# EAGLE design Shield1 (EAGLE 7.2.0)

## Sheet 1 of 2
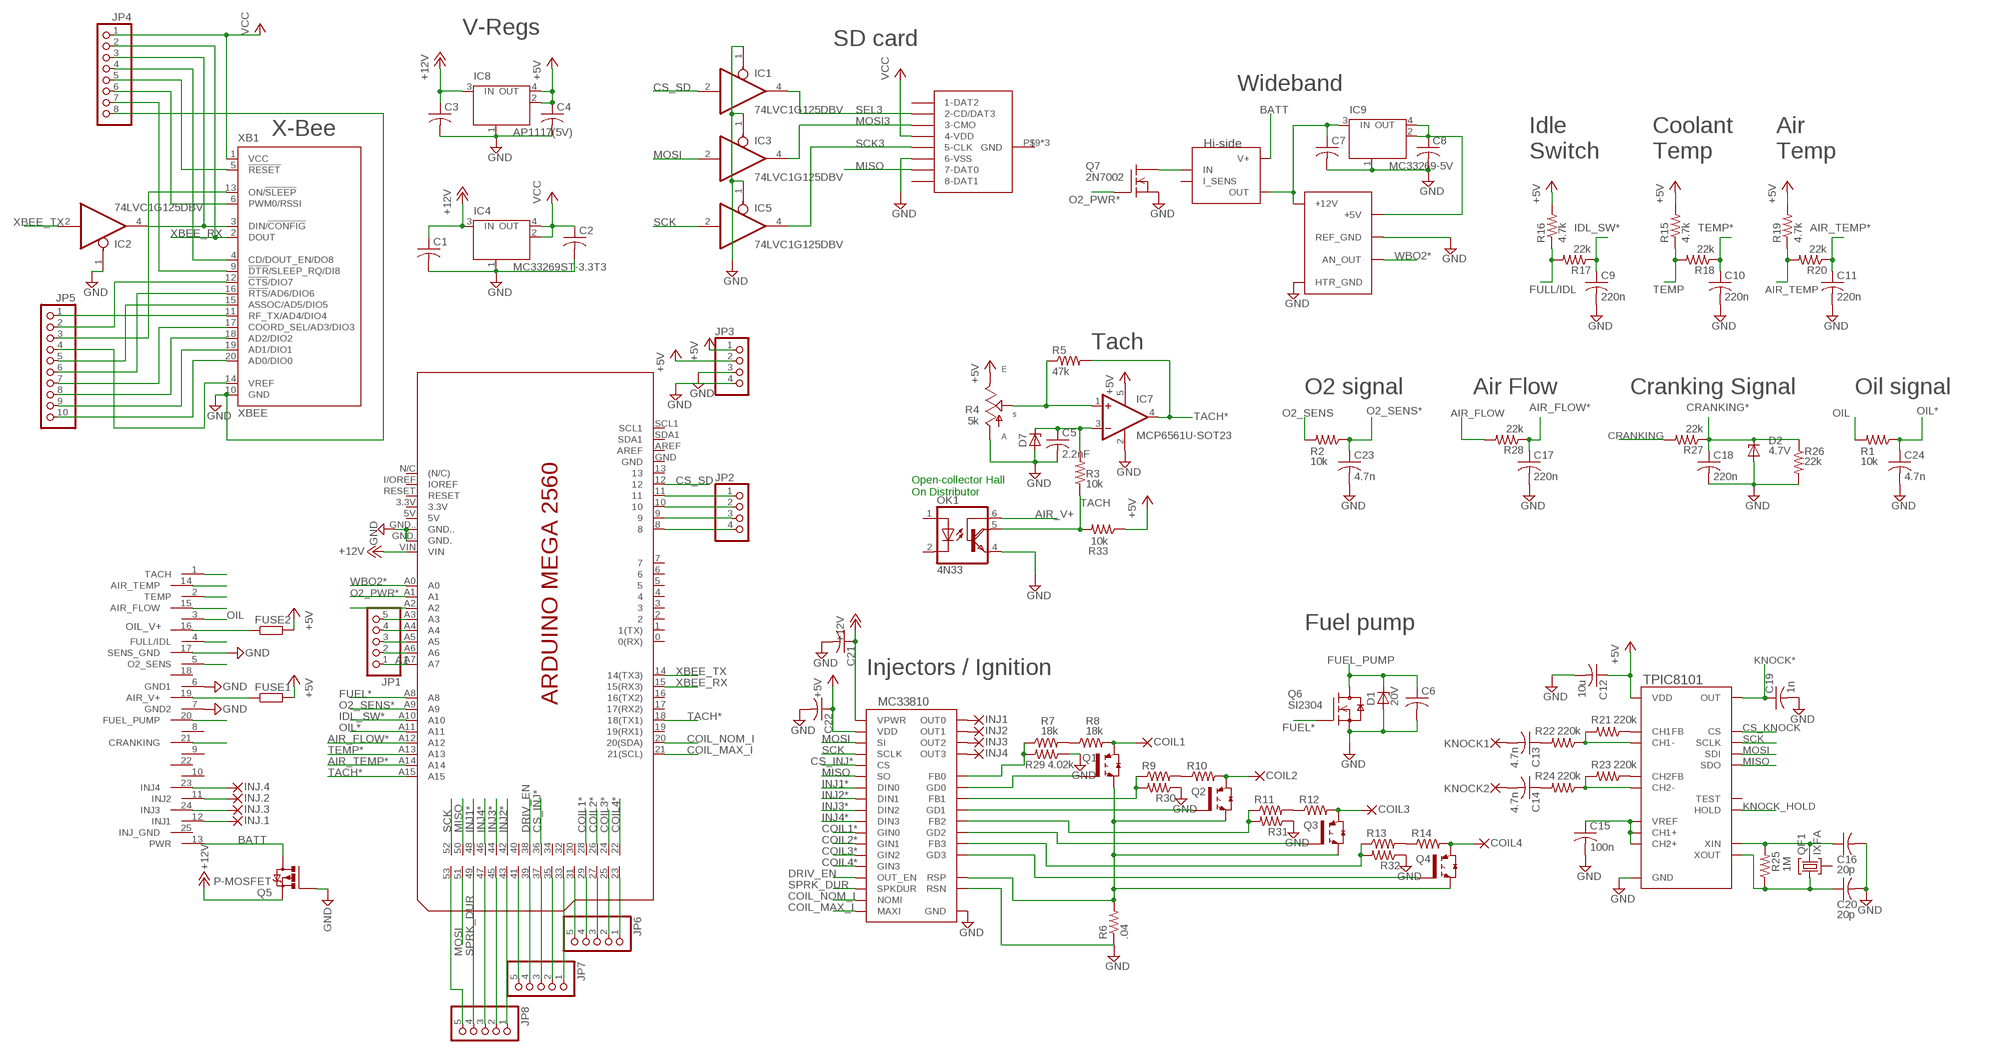
[diagram p0: schematic, sheet 1]

### Parts
C1  C-USC1206  [C1206]
C2  C-USC1206  [C1206]
C3  C-USC1206  [C1206]
C4  C-USC1206  [C1206]
C5  2.2nF  C-USC1206  [C1206]
C6  C-USC1206  [C1206]
C7  C-USC1206  [C1206]
C8  C-USC1206  [C1206]
C9  220n  C-USC1206  [C1206]
C10  220n  C-USC1206  [C1206]
C11  220n  C-USC1206  [C1206]
C12  10u  C-USC1206  [C1206]
C13  4.7n  C-USC1206  [C1206]
C14  4.7n  C-USC1206  [C1206]
C15  100n  C-USC1206  [C1206]
C16  20p  C-USC1206  [C1206]
C17  220n  C-USC1206  [C1206]
C18  220n  C-USC1206  [C1206]
C19  1n  C-USC1206  [C1206]
C20  20p  C-USC1206  [C1206]
C21  C-USC1206  [C1206]
C22  C-USC1206  [C1206]
C23  4.7n  C-USC1206  [C1206]
C24  4.7n  C-USC1206  [C1206]
COIL1  2,15/1,0  [2,15/1,0]
COIL2  2,15/1,0  [2,15/1,0]
COIL3  2,15/1,0  [2,15/1,0]
COIL4  2,15/1,0  [2,15/1,0]
D1  20V  ZENER-DIODESOD123  [SOD123]
D2  4.7V  ZENER-DIODESOD123  [SOD123]
D7  ZENER-DIODESOD80C  [SOD80C]
FUSE1  R-EU_R1206W  [R1206W]
FUSE2  R-EU_R1206W  [R1206W]
IC1  74LVC1G125DBV  [SOT23-5]
IC2  74LVC1G125DBV  [SOT23-5]
IC3  74LVC1G125DBV  [SOT23-5]
IC4  MC33269ST-3.3T3  [SOT223]
IC5  74LVC1G125DBV  [SOT23-5]
IC6  MC33810SSOP  [SSOP32_POWERPAD]
IC7  MCP6561U-SOT23  [SOT23-5]
IC8  AP1117(5V)  MC33269ST-3.3T3  [SOT223]
IC9  MC33269-5V  MC33269ST-3.3T3  [SOT223]
IC11  KNOCK_SENS_IC_TPIC8101  [SO20L]
INJ1  2,15/1,2  [2,15/1,2]
INJ2  2,15/1,2  [2,15/1,2]
INJ3  2,15/1,2  [2,15/1,2]
INJ4  2,15/1,2  [2,15/1,2]
INJ.1  2,15/1,2  [2,15/1,2]
INJ.2  2,15/1,2  [2,15/1,2]
INJ.3  2,15/1,2  [2,15/1,2]
INJ.4  2,15/1,2  [2,15/1,2]
JP1  PINHD-1X5  [1X05]
JP2  PINHD-1X4  [1X04]
JP3  PINHD-1X4  [1X04]
JP4  PINHD-1X8  [1X08]
JP5  PINHD-1X10NARROW  [1X10-N]
JP6  PINHD-1X5  [1X05]
JP7  PINHD-1X5  [1X05]
JP8  PINHD-1X5  [1X05]
KNOCK1  2,15/1,0  [2,15/1,0]
KNOCK2  2,15/1,0  [2,15/1,0]
OK1  4N33  [DIL06]
Q1  ISL9V5036S3S  [D2PACK]
Q2  ISL9V5036S3S  [D2PACK]
Q3  ISL9V5036S3S  [D2PACK]
Q4  ISL9V5036S3S  [D2PACK]
Q5  P-MOSFET  [D-PAK_TO252AA]
Q6  SI2304  [SOT23]
Q7  2N7002  [SOT23]
Q8  BTS6133  [DPACK_5]
QF1  IXFA  [HC49U]
R1  10k  R-US_R1206  [R1206]
R2  10k  R-US_R1206  [R1206]
R3  10k  R-US_R1206  [R1206]
R4  5k  TRIM_US-  [50/45J]
R5  47k  R-US_R1206  [R1206]
R6  .04  R-US_  [0840/27]
R7  18k  R-US_R1210W  [R1210W]
R8  18k  R-US_R1210W  [R1210W]
R9  R-US_R1210W  [R1210W]
R10  R-US_R1210W  [R1210W]
R11  R-US_R1210W  [R1210W]
R12  R-US_R1210W  [R1210W]
R13  R-US_R1210W  [R1210W]
R14  R-US_R1210W  [R1210W]
R15  4.7k  R-US_R1206  [R1206]
R16  4.7k  R-US_R1206  [R1206]
R17  22k  R-US_R1206  [R1206]
R18  22k  R-US_R1206  [R1206]
R19  4.7k  R-US_R1206  [R1206]
R20  22k  R-US_R1206  [R1206]
R21  220k  R-US_R1206  [R1206]
R22  220k  R-US_R1206  [R1206]
R23  220k  R-US_R1206  [R1206]
R24  220k  R-US_R1206  [R1206]
R25  1M  R-US_R1206  [R1206]
R26  22k  R-US_R1206  [R1206]
R27  22k  R-US_R1206  [R1206]
R28  22k  R-US_R1206  [R1206]
R29  4.02k  R-US_R1206  [R1206]
R30  R-US_R1206  [R1206]
R31  R-US_R1206  [R1206]
R32  R-US_R1206  [R1206]
R33  10k  R-US_R1206  [R1206]
U$1  VW_84_CONN  [VW_84_CONN]
U$3  HI-ROSE-DM3D  [DM3D-SF]
U$4  ECOTRON_ALM-BOARD  [ECOTRONS_ALM-BOARD]
U$9  MEGA2560_SMD  [MEGA_NO-PWR/USB/ICSP_SMD]
XB1  XBEE  [XBEE]

### Nets
+5V: C4.1 C12.1 C22.1 FUSE1.2 FUSE2.2 IC6.8(VDD) IC7.5(V+) IC8.2(OUT) IC8.4(OUT) IC11.1(VDD) JP3.1 JP3.2 R4.1(E) R15.2 R16.2 R19.2 R33.1
+12V: C1.1 C3.1 C21.1 IC4.3(IN) IC6.25(VPWR) IC8.3(IN) Q5.3(S) U$9.VIN
A1: JP1.1 U$9.A7
AIR_FLOW: R28.2 U$1.15(AIR_FLOW)
AIR_FLOW*: C17.1 R28.1 U$9.A12
AIR_TEMP: R19.1 R20.2 U$1.14(AIR_TEMP)
AIR_TEMP*: C11.1 R20.1 U$9.A14
AIR_V+: FUSE1.1 OK1.6(B) U$1.19(AIR_V+)
BATT: Q5.4(D) Q8.3(V+) U$1.13(PWR)
COIL1: COIL1.1(P) Q1.2(C) R8.2
COIL1*: IC6.24(GIN0) U$9.28
COIL2: COIL2.1(P) Q2.2(C) R10.2
COIL2*: IC6.23(GIN1) U$9.26
COIL3: COIL3.1(P) Q3.2(C) R12.2
COIL3*: IC6.22(GIN2) U$9.24
COIL4: COIL4.1(P) Q4.2(C) R14.2
COIL4*: IC6.21(GIN3) U$9.22
COIL_MAX_I: IC6.29(MAXI) U$9.21(21(SCL))
COIL_NOM_I: IC6.28(NOMI) U$9.20(20(SDA))
CRANKING: R27.2 U$1.21(CRANKING)
CRANKING*: C18.1 D2.C R26.1 R27.1
CS_INJ*: IC6.4(CS) U$9.36
CS_KNOCK: IC11.8(CS)
CS_SD: IC1.2(I) U$9.12
DRIV_EN: IC6.9(OUT_EN) U$9.38
FUEL*: Q6.1(G) U$9.A8
FUEL_PUMP: C6.1 D1.C Q6.3(D) U$1.20(FUEL_PUMP)
FULL/IDL: R16.1 R17.2 U$1.4(FULL/IDL)
GND: C1.2 C2.2 C3.2 C4.2 C5.2 C6.2 C7.2 C8.2 C9.2 C10.2 C11.2 C12.2 C15.2 C16.2 C17.2 C18.2 C19.2 C20.2 C21.2 C22.2 C23.2 C24.2 D1.A D2.A D7.A IC1.1(OE) IC2.1(OE) IC3.1(OE) IC4.1(GND/ADJ) IC5.1(OE) IC6.27(RSN) IC6.GND IC6.V1(GND) IC6.V2(GND) IC6.V3(GND) IC6.V4(GND) IC6.V5(GND) IC7.2(V-) IC8.1(GND/ADJ) IC9.1(GND/ADJ) IC11.2(GND) JP3.3 JP3.4 JP4.8 OK1.4(E) Q5.1(G) Q6.2(S) Q7.2(S) R4.3(A) R6.1 R26.2 R29.1 R30.1 R31.1 R32.1 U$1.6(GND1) U$1.7(GND2) U$1.17(SENS_GND) U$3.P$3(6-VSS) U$4.P$2(HTR_GND) U$4.P$3(REF_GND) U$4.P$6(REF_GND) U$4.P$9(HTR_GND) U$9.GND. U$9.GND.. XB1.10(GND)
IDL_SW*: C9.1 R17.1 U$9.A10
INJ1: INJ.1.1(P) U$1.12(INJ1)
INJ1*: IC6.10(DIN0) U$9.48
INJ2: INJ.2.1(P) U$1.11(INJ2)
INJ2*: IC6.11(DIN1) U$9.42
INJ3: INJ.3.1(P) U$1.24(INJ3)
INJ3*: IC6.12(DIN2) U$9.44
INJ4: INJ.4.1(P) U$1.23(INJ4)
INJ4*: IC6.13(DIN3) U$9.46
KNOCK*: C19.1 IC11.4(OUT) U$9.A2
KNOCK_HOLD: IC11.7(HOLD)
MISO: IC6.7(SO) IC11.11(SDO) U$3.P$2(7-DAT0) U$9.50
MOSI: IC3.2(I) IC6.6(SI) IC11.12(SDI) U$9.51
MOSI3: IC3.4(O) U$3.P$6(3-CMO)
N$1: C5.1 D7.C IC7.3(-IN) R3.2
N$2: C7.1 IC9.3(IN) Q8.1(OUT) Q8.5(OUT) U$4.P$1(+12V) U$4.P$10(+12V)
N$3: IC6.26(RSP) Q1.3(E) Q2.3(E) Q3.3(E) Q4.3(E) R6.2
N$4: IC6.14(GD1) Q2.1(G)
N$6: IC6.2(FB0) R7.1 R29.2
N$7: IC6.3(GD0) Q1.1(G)
N$8: Q7.3(D) Q8.2(IN)
N$9: IC6.1(OUT0) INJ1.1(P)
N$10: IC11.19(CH1-) R21.2 R22.1
N$11: IC7.1(+IN) R4.2(S) R5.1
N$12: IC6.15(FB1) R9.1 R30.2
N$13: IC6.30(GD2) Q3.1(G)
N$14: IC2.4(O) JP4.3 XB1.3(DIN/!CONFIG)
N$15: C8.1 IC9.2(OUT) IC9.4(OUT) U$4.P$4(+5V)
N$16: IC6.31(FB2) R11.1 R31.2
N$17: IC6.19(GD3) Q4.1(G)
N$18: IC11.18(CH1FB) R21.1
N$19: IC6.18(FB3) R13.1 R32.2
N$20: C13.1 R22.2
N$21: IC11.16(CH2-) R23.2 R24.1
N$22: C14.1 R24.2
N$23: C15.1 IC11.3(VREF) IC11.15(CH2+) IC11.20(CH1+)
N$24: IC11.17(CH2FB) R23.1
N$26: IC6.16(OUT1) INJ2.1(P)
N$27: IC6.32(OUT2) INJ3.1(P)
N$28: C20.1 IC11.10(XOUT) QF1.1 R25.1
N$30: C16.1 IC11.9(XIN) QF1.3 R25.2
N$31: IC6.17(OUT3) INJ4.1(P)
N$34: C13.2 KNOCK1.1(P)
N$35: C14.2 KNOCK2.1(P)
N$36: JP6.1 U$9.23
N$43: R7.2 R8.1
N$44: R9.2 R10.1
N$45: R11.2 R12.1
N$46: R13.2 R14.1
N$49: JP1.2 U$9.A6
N$50: JP1.3 U$9.A5
N$51: JP1.4 U$9.A4
N$52: JP1.5 U$9.A3
N$53: JP2.1 U$9.11
N$54: JP2.2 U$9.10
N$55: JP2.3 U$9.9
N$56: JP2.4 U$9.8
N$57: JP4.4 XB1.4(CD/DOUT_EN/DO8)
N$58: JP4.5 XB1.5(!RESET)
N$59: JP4.6 XB1.6(PWM0/RSSI)
N$60: JP5.10 XB1.20(AD0/DIO0)
N$61: JP5.9 XB1.19(AD1/DIO1)
N$62: JP5.8 XB1.18(AD2/DIO2)
N$63: JP5.7 XB1.17(COORD_SEL/AD3/DIO3)
N$64: JP5.6 XB1.16(!RTS!/AD6/DIO6)
N$65: JP5.5 XB1.15(ASSOC/AD5/DIO5)
N$66: JP5.4 XB1.14(VREF)
N$67: JP5.3 XB1.13(ON/!SLEEP)
N$68: JP5.2 XB1.12(!CTS!/DIO7)
N$69: JP5.1 XB1.11(RF_TX/AD4/DIO4)
N$70: JP4.7 XB1.9(!DTR!/SLEEP_RQ/DI8)
N$71: JP6.2 U$9.25
N$72: JP6.3 U$9.27
N$73: JP6.4 U$9.29
N$74: JP6.5 U$9.31
N$75: JP7.1 U$9.33
N$76: JP7.2 U$9.35
N$77: JP7.3 U$9.37
N$78: JP7.4 U$9.39
N$79: JP7.5 U$9.41
N$80: JP8.1 U$9.43
N$81: JP8.2 U$9.45
N$82: JP8.3 U$9.47
N$83: JP8.5 U$9.53
O2_PWR*: Q7.1(G) U$9.A1
O2_SENS: R2.2 U$1.5(O2_SENS)
O2_SENS*: C23.1 R2.1 U$9.A9
OIL: R1.2 U$1.3
OIL*: C24.1 R1.1 U$9.A11
OIL_V+: FUSE2.1 U$1.16
SCK: IC5.2(I) IC6.5(SCLK) IC11.13(SCLK) U$9.52
SCK3: IC5.4(O) U$3.P$4(5-CLK)
SEL3: IC1.4(O) U$3.P$7(2-CD/DAT3)
SPRK_DUR: IC6.20(SPKDUR) JP8.4 U$9.49
TACH: OK1.5(COL) R3.1 R33.2 U$1.1(TACH)
TACH*: IC7.4(OUT) R5.2 U$9.18(18(TX1)) U$9.A15
TEMP: R15.1 R18.2 U$1.2(TEMP)
TEMP*: C10.1 R18.1 U$9.A13
VCC: C2.1 IC4.2(OUT) IC4.4(OUT) JP4.1 U$3.P$5(4-VDD) XB1.1(VCC)
WBO2*: U$4.P$7(AN_OUT) U$9.A0
XBEE_RX: JP4.2 U$9.15(15(RX3)) XB1.2(DOUT)
XBEE_TX: IC2.2(I) U$9.14(14(TX3))
Unconnected: IC11.14(TEST) OK1.1(A) OK1.2(C) Q8.4(I_SENS) QF1.2 U$1.8 U$1.9 U$1.10 U$1.18 U$1.22 U$1.25(INJ_GND) U$3.P$1(8-DAT1) U$3.P$8(1-DAT2) U$9.0(0(RX)) U$9.1(1(TX)) U$9.2 U$9.3 U$9.3.3V U$9.4 U$9.5 U$9.5V U$9.6 U$9.7 U$9.13 U$9.16(16(TX2)) U$9.17(17(RX2)) U$9.19(19(RX1)) U$9.30 U$9.32 U$9.34 U$9.40 U$9.AREF U$9.GND U$9.I/OREF(IOREF) U$9.N/C((N/C)) U$9.RESET U$9.SCL1 U$9.SDA1

### Notes on the sheet
- V-Regs
- SD card
- Wideband
- X-Bee
- Idle
  Switch
- Coolant
  Temp
- Air
  Temp
- Tach
- O2 signal | Air Flow | Cranking Signal | Oil signal
- Open-collector Hall
  On Distributor
- Fuel pump
- Injectors / Ignition

## Sheet 2 of 2

## Power pins joined to a net without a drawn wire
GND: IC1.3(GND) IC2.3(GND) IC3.3(GND) IC5.3(GND) U$3.P$9(GND) U$3.P$10(GND) U$3.P$11(GND)
VCC: IC1.5(VCC) IC2.5(VCC) IC3.5(VCC) IC5.5(VCC)

## Library data of the parts
C1-C24 = rcl:C-US: CAPACITOR, American symbol
COIL1-COIL4 KNOCK1 KNOCK2 = wirepad:2,15/1,0: THROUGH-HOLE PAD
D1 D2 D7 = diode:ZENER-DIODE: Z-Diode
FUSE1 FUSE2 = rcl:R-EU_: RESISTOR, European symbol
IC1-IC3 IC5 = 74xx-little-us:74*1G125: Single Bus Buffer Gate with 3-State Output
IC4 IC8 IC9 = linear:MC33269ST*: Adjustable Output Low Dropout Voltage Regulator 800 mA Source: http://www.onsemi.com/pub/Collateral/MC33269-D.PDF
IC6 = engine control:MC33810
IC7 = op amps, comparators:*-SOT23: Single Op Amp Low Power, Single-Supply, Rail-To-Rail Operational Amplifier Source: http://focus.ti.com/lit/ds/symlink/opa2345.pdf
IC11 = engine control:KNOCK_SENS_IC
INJ1-INJ4 INJ.1-INJ.4 = wirepad:2,15/1,2
JP1 JP6-JP8 = pinhead:PINHD-1X5: PIN HEADER
JP2 JP3 = pinhead:PINHD-1X4: PIN HEADER
JP4 = pinhead:PINHD-1X8: PIN HEADER
JP5 = pinhead:PINHD-1X10: PIN HEADER
OK1 = optocoupler:4N33: MOTOROLA OPTO COUPLER; MF: VISHAY/TELEFUNKEN; MPN: 4N33; OC_FARNELL: 1469601; OC_NEWARK: 88K1390
Q1-Q4 = transistors_MGT:ISL9V5036S3: INSULATED GATE BIPOLAR TRANSISTOR WITH ULTRAFAST SOFT RECOVERY DIODE
Q5 = transistors_MGT:P-MOSFET: P-CHANNEL MOS-FET SYMBOL
Q6 = transistors_MGT:SI2304
Q7 = transistors_MGT:2N7002
Q8 = drivers:BTS6133
QF1 = crystal:IXF: Crystal Filter Source: www.ilsiamerica.com .. C1 IXF Series.pdf; OC_FARNELL: unknown; OC_NEWARK: unknown
R1-R3 R5-R33 = rcl:R-US_: RESISTOR, American symbol
R4 = pot:TRIM_US-: POTENTIOMETER
U$1 = ECU_parts:VW_84_CONN
U$3 = SD-card:HI-ROSE-DM3D
U$4 = engine control:ECOTRON_ALM-BOARD
U$9 = arduinos:MEGA2560_SMD
XB1 = maxstream:XBEE: XBee (TM) /XBee-PRO(TM) OEM RF Modules Source: MaxStream, Inc. xbee_productmanual.pdf; MPN: XBP24-Z7UIT-004; OC_FARNELL: 1751799; OC_NEWARK: 34R5507

## Board
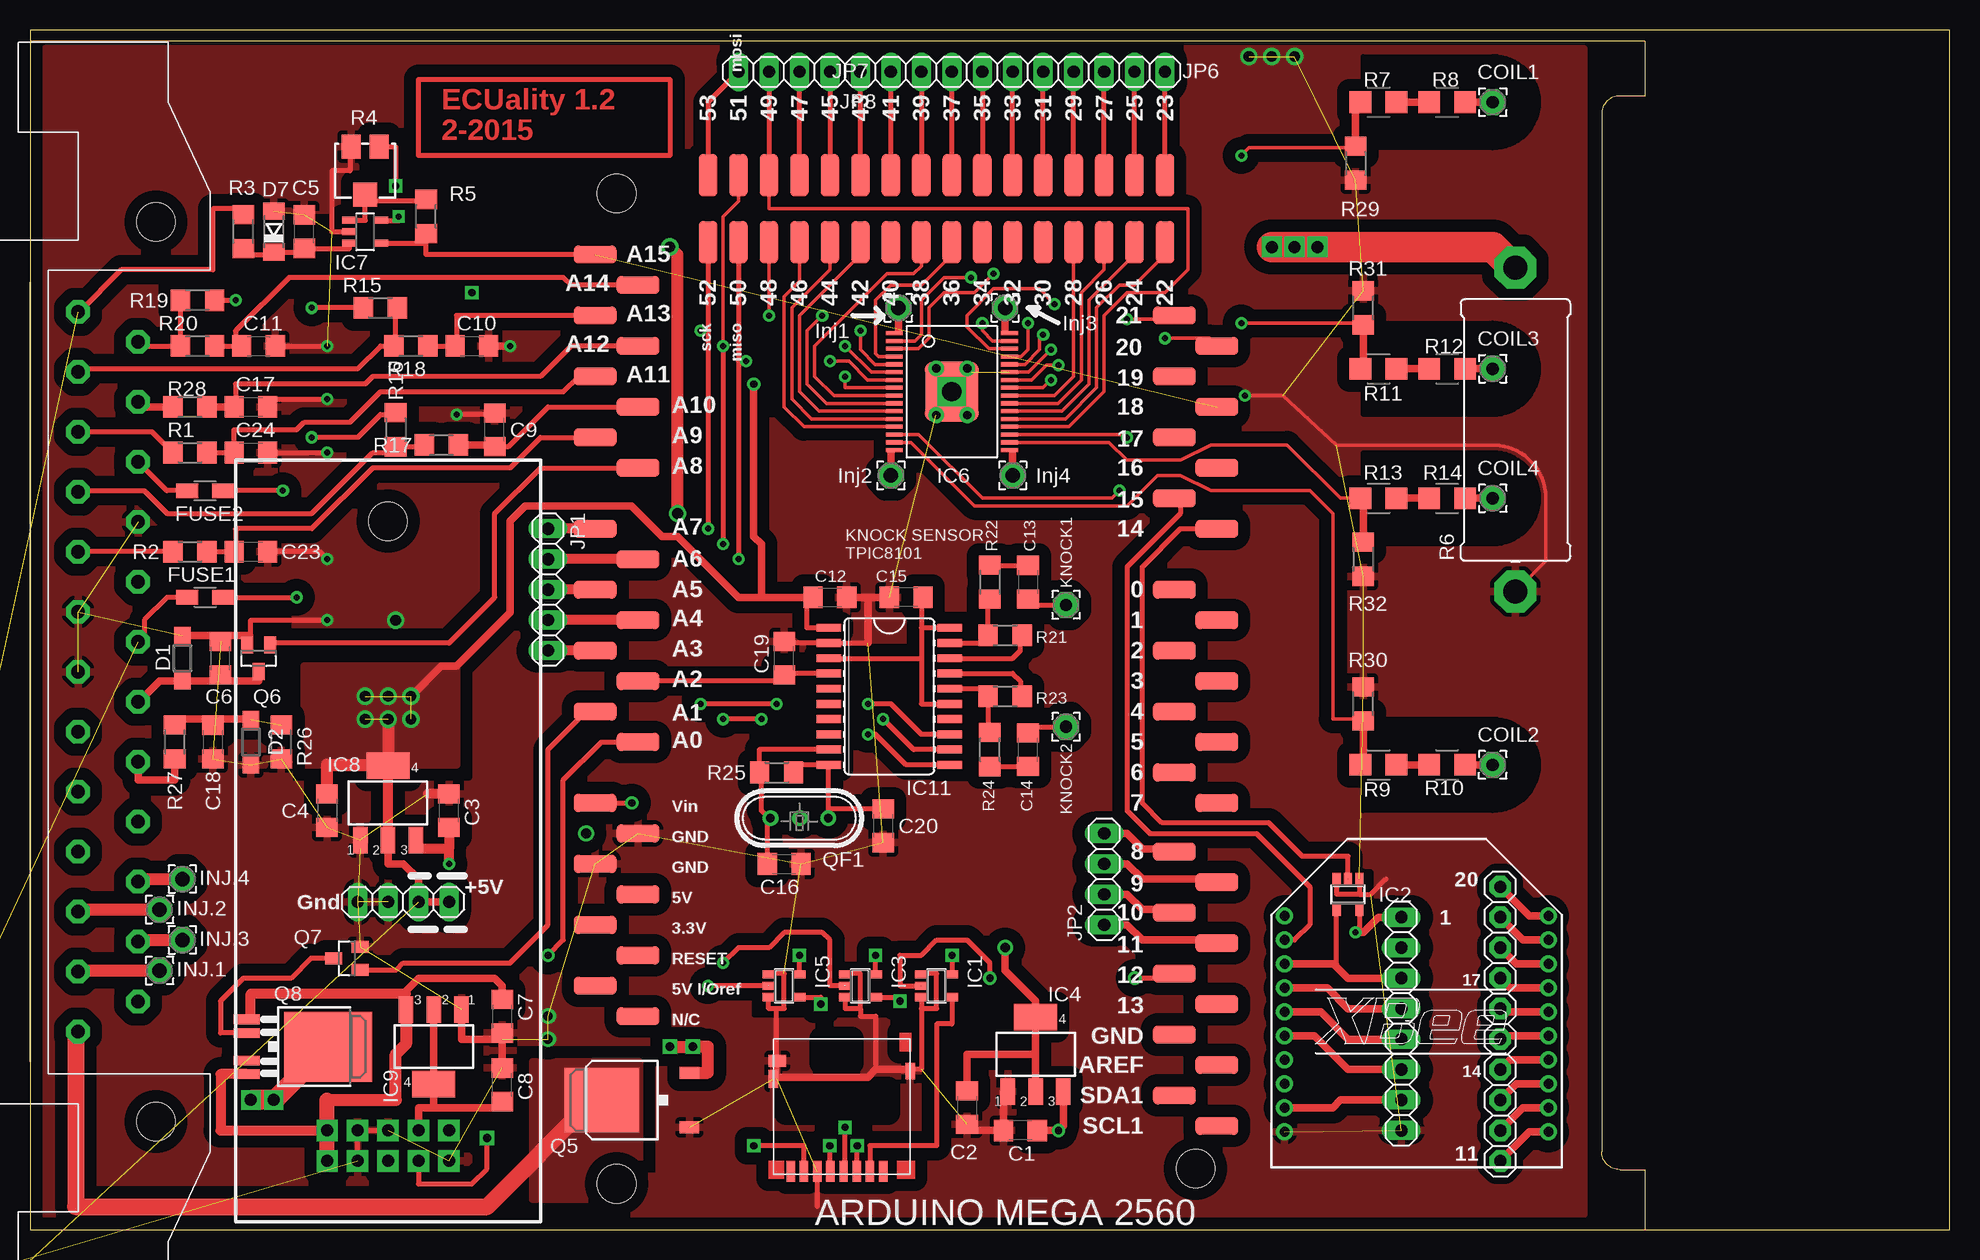
[diagram p1: board, top side]
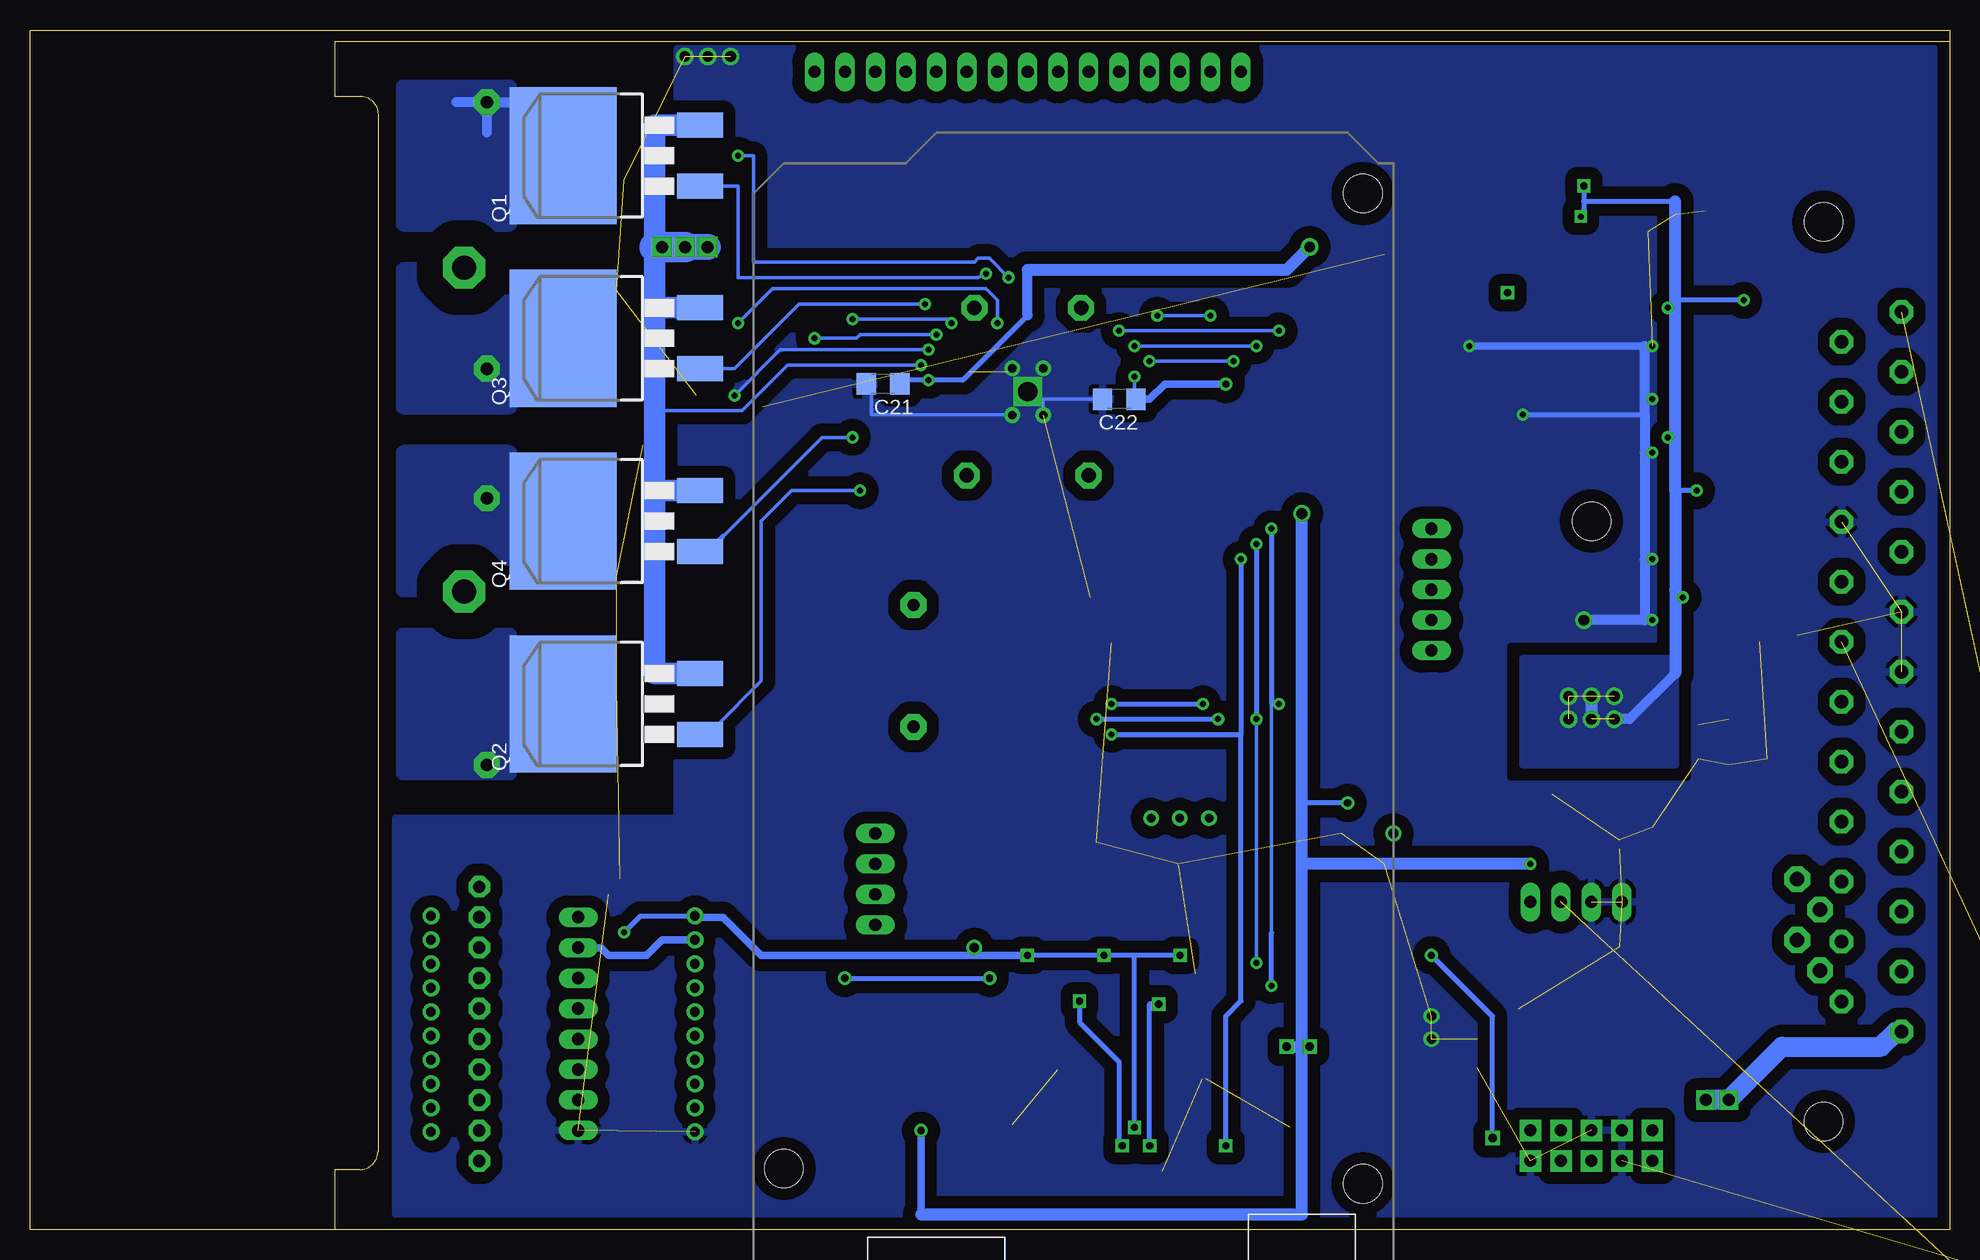
[diagram p2: board, bottom side, seen from below]

Size 160 x 100 mm. Coordinates in mm from the lower left corner, seen from the top.
Outline: 0,0 160,0 160,100 0,100 0,0
Copper layers (1*16): Top 0.035mm / dielectric 1.5mm / Bottom 0.035mm
Design rules "default *": minimum track width 10mil, minimum drill 17mil, track to track 8mil, track to pad 8mil, pad to pad 8mil, via to via 8mil, smd to smd 8mil, copper to edge 25mil, drill to drill 8mil, minimum pad ring 12mil, minimum via ring 10mil, stop-mask expansion 4mil, vias tented up to drill 0mil, thermal gap 14mil
Milling: 10 lines

### Footprints (pad centres in the part's own frame; a part is rotated, then mirrored left to right if it is on the bottom)
C1206 = smd 1.6 x 1.8: 1 -1.4,0; 2 1.4,0
2,15/1,0 = drill 1.016 pad 2.159 octagon: 1 0,0
SOD123 = smd 1.4 x 1.4: A 1.9,0; C -1.9,0
SOD80C = smd 1.4 x 1.8: A 1.7,0; C -1.7,0
R1206W = smd 1.8 x 1.2: 1 -1.499,0; 2 1.499,0
SOT23-5 = smd 0.69 x 0.99: 1 -0.95,-1.29; 2 0,-1.29; 3 0.95,-1.29; 4 0.95,1.3; 5 -0.95,1.3
SOT223 = smd 1.219 x 2.235: 1 -2.311,-3.099; 2 0,-3.099; 3 2.311,-3.099 | smd 3.6 x 2.2: 4 0,3.099
SSOP32_POWERPAD = smd 0.348 x 1.397: 1 -4.875,-4.8; 2 -4.225,-4.8; 3 -3.575,-4.8; 4 -2.925,-4.8; 5 -2.275,-4.8; 6 -1.625,-4.8; 7 -0.975,-4.8; 8 -0.325,-4.8; 9 0.325,-4.8; 10 0.975,-4.8; 11 1.625,-4.8; 12 2.275,-4.8; 13 2.925,-4.8; 14 3.575,-4.8; 15 4.225,-4.8; 16 4.875,-4.8; 17 4.875,4.8; 18 4.225,4.8; 19 3.575,4.8; 20 2.925,4.8; 21 2.275,4.8; 22 1.625,4.8; 23 0.975,4.8; 24 0.325,4.8; 25 -0.325,4.8; 26 -0.975,4.8; 27 -1.625,4.8; 28 -2.275,4.8; 29 -2.925,4.8; 30 -3.575,4.8; 31 -4.225,4.8; 32 -4.875,4.8 | smd 5 x 4.5: GND 0,0 | drill 0.7: V1 -1.95,1.3; V2 1.95,1.3; V3 -1.95,-1.3; V4 1.95,-1.3 | drill 1.6 square: V5 0,0
SOT23-5' = smd 1.2 x 0.6: 1 -1.306,0.95; 2 -1.306,0; 3 -1.306,-0.95; 4 1.306,-0.95; 5 1.306,0.95
SO20L = smd 0.66 x 2.032: 1 -5.715,-5.029; 2 -4.445,-5.029; 3 -3.175,-5.029; 4 -1.905,-5.029; 5 -0.635,-5.029; 6 0.635,-5.029; 7 1.905,-5.029; 8 3.175,-5.029; 9 4.445,-5.029; 10 5.715,-5.029; 11 5.715,5.029; 12 4.445,5.029; 13 3.175,5.029; 14 1.905,5.029; 15 0.635,5.029; 16 -0.635,5.029; 17 -1.905,5.029; 18 -3.175,5.029; 19 -4.445,5.029; 20 -5.715,5.029
2,15/1,2 = drill 1.2 pad 2.159 octagon: 1 0,0
1X05 = drill 1.016 long: 1 -5.08,0; 2 -2.54,0; 3 0,0; 4 2.54,0; 5 5.08,0
1X04 = drill 1.016 long: 1 -3.81,0; 2 -1.27,0; 3 1.27,0; 4 3.81,0
1X08 = drill 1.016 long: 1 -8.89,0; 2 -6.35,0; 3 -3.81,0; 4 -1.27,0; 5 1.27,0; 6 3.81,0; 7 6.35,0; 8 8.89,0
1X10-N = drill 1.016 pad 1.778 octagon: 1 -11.43,0; 2 -8.89,0; 3 -6.35,0; 4 -3.81,0; 5 -1.27,0; 6 1.27,0; 7 3.81,0; 8 6.35,0; 9 8.89,0; 10 11.43,0
DIL06 = drill 0.813 offset: 1 -2.54,-3.81; 2 0,-3.81; 3 2.54,-3.81; 4 2.54,3.81; 5 0,3.81; 6 -2.54,3.81
D2PACK = smd 2.083 x 3.81: 1 -2.54,-8.89; 3 2.54,-8.89 | smd 11.43 x 8.89: 2 0,2.54
D-PAK_TO252AA = smd 1 x 1.6: 1 -2.28,-4.8; 3 2.28,-4.8 | smd 5.4 x 6.2: 4 0,2.5
SOT23 = smd 1 x 1.4: 1 -0.95,-1.1; 2 0.95,-1.1; 3 0,1.1
DPACK_5 = smd 0.8 x 2.2: 1 -2.28,-4.8; 2 -1.14,-4.8; 4 1.14,-4.8; 5 2.28,-4.8 | smd 5.8 x 7.4: 3 0,2
HC49U = drill 0.7 pad 1.2: 1 -2.413,0; 2 -0.027,0; 3 2.413,0
R1206 = smd 1.6 x 1.803: 1 -1.422,0; 2 1.422,0
50/45J = smd 2 x 1.6: 1 -2,1.175; 3 -2,-1.175 | smd 2 x 2: 2 2,0
0840/27 = drill 2 pad 3.5 octagon: 1 -13.5,0; 2 13.5,0
R1210W = smd 1.8 x 1.8: 1 -1.499,0; 2 1.499,0
VW_84_CONN = drill 1.1 pad 1.93 octagon: 1 2.5,30; 2 2.5,25; 3 2.5,20; 4 2.5,15; 5 2.5,10; 6 2.5,5; 7 2.5,0; 8 2.5,-5; 9 2.5,-10; 10 2.5,-15; 11 2.5,-20; 12 2.5,-25; 13 2.5,-30; 14 7.5,27.5; 15 7.5,22.5; 16 7.5,17.5; 17 7.5,12.5; 18 7.5,7.5; 19 7.5,2.5; 20 7.5,-2.5; 21 7.5,-7.5; 22 7.5,-12.5; 23 7.5,-17.5; 24 7.5,-22.5; 25 7.5,-27.5 | hole 3.2: 9,37.5; 9,-37.5
DM3D-SF = smd 0.7 x 1.75: P$1 0.55,-0.875; P$2 1.65,-0.875; P$3 2.75,-0.875; P$4 3.85,-0.875; P$5 4.95,-0.875; P$6 6.05,-0.875; P$7 7.15,-0.875; P$8 8.25,-0.875 | smd 0.8 x 1.5: P$9 -0.9,6.85 | smd 0.8 x 1.4: P$10 10.5,7.5 | smd 1.45 x 1: P$11 -0.575,8.35
ECOTRONS_ALM-BOARD = drill 1 pad 1.778 square: P$1 55.88,7.62; P$2 55.88,10.16; P$3 55.88,12.7; P$4 55.88,15.24; P$5 55.88,17.78; P$6 58.42,17.78; P$7 58.42,15.24; P$8 58.42,12.7; P$9 58.42,10.16; P$10 58.42,7.62 | hole 3.2: 5.08,12.7
MEGA_NO-PWR/USB/ICSP_SMD = smd 1.524 x 3.556 bottom: 0 63.5,49.022; 1 60.96,52.578; 2 58.42,49.022; 3 55.88,52.578; 3.3V 35.56,0.762; 4 53.34,49.022; 5 50.8,52.578; 5V 38.1,4.318; 6 48.26,49.022; 7 45.72,52.578; 8 41.656,49.022; 9 39.116,52.578; 10 36.576,49.022; 11 34.036,52.578; 12 31.496,49.022; 13 28.956,52.578; 14 68.58,52.578; 15 71.12,49.022; 16 73.66,52.578; 17 76.2,49.022; 18 78.74,52.578; 19 81.28,49.022; 20 83.82,52.578; 21 86.36,49.022; A0 50.8,4.318; A1 53.34,0.762; A2 55.88,4.318; A3 58.42,0.762; A4 60.96,4.318; A5 63.5,0.762; A6 66.04,4.318; A7 68.58,0.762; A8 73.66,4.318; A9 76.2,0.762; A10 78.74,4.318; A11 81.28,0.762; A12 83.82,4.318; A13 86.36,0.762; A14 88.9,4.318; A15 91.44,0.762; AREF 23.876,52.578; GND 26.416,49.022; GND. 43.18,4.318; GND.. 40.64,0.762; I/OREF 30.48,0.762; N/C 27.94,4.318; RESET 33.02,4.318; SCL1 18.796,52.578; SDA1 21.336,49.022; VIN 45.72,0.762 | smd 3.556 x 1.524 bottom: 22 92.456,48.26; 23 98.044,48.26; 24 92.456,45.72; 25 98.044,45.72; 26 92.456,43.18; 27 98.044,43.18; 28 92.456,40.64; 29 98.044,40.64; 30 92.456,38.1; 31 98.044,38.1; 32 92.456,35.56; 33 98.044,35.56; 34 92.456,33.02; 35 98.044,33.02; 36 92.456,30.48; 37 98.044,30.48; 38 92.456,27.94; 39 98.044,27.94; 40 92.456,25.4; 41 98.044,25.4; 42 92.456,22.86; 43 98.044,22.86; 44 92.456,20.32; 45 98.044,20.32; 46 92.456,17.78; 47 98.044,17.78; 48 92.456,15.24; 49 98.044,15.24; 50 92.456,12.7; 51 98.044,12.7; 52 92.456,10.16; 53 98.044,10.16 | hole 3.2: 15.24,50.8; 13.97,2.54; 96.52,2.54
XBEE = drill 0.8 pad 1.27: 1 -11,9; 2 -11,7; 3 -11,5; 4 -11,3; 5 -11,1; 6 -11,-1; 7 -11,-3; 8 -11,-5; 9 -11,-7; 10 -11,-9; 11 11,-9; 12 11,-7; 13 11,-5; 14 11,-3; 15 11,-1; 16 11,1; 17 11,3; 18 11,5; 19 11,7; 20 11,9

### Placement (x,y rotation side)
C1  82.55,8.26 180 top
C2  78.11,10.16 270 top
C3  34.92,34.92 90 top
C4  24.77,34.92 270 top
C5  22.86,83.19 90 top
C6  15.88,47.62 90 top
C7  39.37,17.78 270 top
C8  39.37,12.06 90 top
C9  38.73,66.67 90 top
C10  36.83,73.66 0 top
C11  19.05,73.66 0 top
C12  66.67,52.7 0 top
C13  83.19,53.98 270 top
C14  83.19,40.01 90 top
C15  73.03,52.7 180 top
C16  62.87,30.48 0 top
C17  18.41,68.58 0 top
C18  15.24,40.64 270 top
C19  62.87,47.62 90 top
C20  71.12,33.66 270 top
C21  88.9,70.48 180 bottom
C22  69.22,69.22 180 bottom
C23  18.41,56.52 0 top
C24  18.41,64.77 0 top
COIL1  121.92,93.98 90 top
COIL2  121.92,38.73 270 top
COIL3  121.92,71.75 180 top
COIL4  121.92,60.96 0 top
D1  12.7,47.62 90 top
D2  18.41,40.64 270 top
D7  20.32,83.19 90 top
FUSE1  14.61,52.7 0 top
FUSE2  14.61,61.59 0 top
IC1  75.56,20.32 270 top
IC2  109.86,27.94 180 top
IC3  69.22,20.32 270 top
IC4  83.82,14.61 0 top
IC5  62.87,20.32 270 top
IC6  76.83,69.85 270 top
IC7  MCP6561U-SOT23  [SOT23-5']  27.94,83.19 0 top
IC8  29.84,35.56 0 top
IC9  33.66,15.24 180 top
IC11  71.63,44.45 270 top
INJ1  72.39,76.83 270 top
INJ2  71.75,62.87 90 top
INJ3  81.28,76.83 270 top
INJ4  81.92,62.87 90 top
INJ.1  10.79,21.59 0 top
INJ.2  10.79,26.67 0 top
INJ.3  12.7,24.13 0 top
INJ.4  12.7,29.21 0 top
JP1  43.18,53.34 270 top
JP2  89.53,29.21 90 top
JP3  31.11,27.3 180 top
JP4  114.3,17.14 270 top
JP5  122.56,17.14 90 top
JP6  89.53,96.52 180 top
JP7  76.83,96.52 180 top
JP8  64.14,96.52 180 top
KNOCK1  86.36,52.07 0 top
KNOCK2  86.36,41.91 270 top
OK1  -13.97,-9.53 0 top  (outside the outline)
Q1  113.03,89.53 90 bottom
Q2  113.03,43.81 90 bottom
Q3  113.03,74.3 90 bottom
Q4  113.03,59.05 90 bottom
Q5  50.16,10.79 90 top
Q6  19.05,47.62 180 top
Q7  26.42,22.61 90 top
Q8  22.86,15.24 270 top
QF1  64.14,34.29 180 top
R1  13.34,64.77 180 top
R2  13.34,56.52 180 top
R3  17.78,83.19 270 top
R4  27.94,88.27 270 top
R5  33.02,84.45 270 top
R6  123.83,66.67 90 top
R7  112.39,93.98 0 top
R8  118.11,93.98 0 top
R9  112.39,38.73 0 top
R10  118.11,38.73 0 top
R11  112.39,71.75 0 top
R12  118.11,71.75 0 top
R13  112.39,60.96 0 top
R14  118.11,60.96 0 top
R15  29.21,76.83 180 top
R16  30.48,66.67 90 top
R17  34.29,65.41 180 top
R18  31.75,73.66 180 top
R19  13.97,77.47 0 top
R20  13.97,73.66 180 top
R21  81.28,49.53 180 top
R22  80.01,53.98 90 top
R23  81.28,44.45 180 top
R24  80.01,40.01 270 top
R25  62.23,38.1 180 top
R26  20.95,40.64 270 top
R27  12.06,40.64 270 top
R28  13.34,68.58 180 top
R29  110.49,88.9 90 top
R30  111.12,43.81 270 top
R31  111.12,76.83 270 top
R32  111.12,55.88 90 top
R33  -17.14,-19.68 0 top  (outside the outline)
U$1  1.5,46.5 0 top
U$3  62.87,5.71 0 top
U$4  17.14,64.14 270 top
U$9  46.35,-10.16 90 bottom
XB1  115.57,17.14 0 top

### Tracks (layer width: path | path; a pad name or v marks a point on that pad's centre or on a via)
+5V  (via drill 0.5, 0.5 pad 0.3, 0.6, 0.6 pad 0.3, 0.9)  (5 unrouted)
  Top 0.305: IC6.8 67.94,70.17 v67.94,71.12
  Top 0.406: R4.1 30.48,90.27 v30.48,87 | v30.73,84.45 30.73,84.07 29.25,84.07 IC7.5 | v23.5,66.04 27.3,66.04 29.21,67.94 30.48,67.94 R16.2 | R15.2 v23.5,76.83 | R19.2 v17.14,77.47 | FUSE1.2 v22.23,52.7 | IC11.1 64.77,50.16 64.77,52.7 C12.1 | v21.08,61.59 FUSE2.2
  Top 0.61: C12.1 60.96,52.7 | 60.96,52.7 59.05,52.7 53.98,57.78 52.7,57.78 50.16,60.33 41.27,60.33 40.01,59.05 40.01,51.44 35.56,46.99 34.29,46.99 v31.75,44.45 | IC8.2 29.84,30.48 31.11,30.48 32.38,29.21 JP3.2 JP3.1 | v60.33,70.48 60.33,57.78 60.96,57.15 60.96,52.7
  Top 0.813: IC8.2 IC8.4
  Top 1.016: v29.84,42.55 IC8.4 29.84,38.73 24.77,38.73 C4.1
  Bottom 0.305: v67.94,71.12 67.94,69.22 C22.1
  Bottom 0.406: v30.48,87 30.48,85.72 | 30.48,85.72 30.48,84.45 v30.73,84.45 | v21.08,61.59 22.86,61.59 | 30.48,85.72 22.86,85.72 | v23.5,66.04 22.86,66.04 | v23.5,76.83 22.86,77.47 v17.14,77.47 | v22.23,52.7 22.86,53.34
  Bottom 0.61: C22.1 66.67,69.22 65.41,70.48 v60.33,70.48
  Bottom 0.813: 22.86,46.35 26.67,42.55 v27.94,42.55
  Bottom 1.016: v29.84,44.45 v29.84,42.55 | 22.86,85.72 22.86,77.47 22.86,66.04 22.86,61.59 22.86,53.34 22.86,46.35
  other vias: 31.75,42.55 27.94,44.45
  pour Top (isolate 1.016, no thermals): 22.86,38.73 35.56,38.73 35.56,46.99 22.86,46.99
  pour Bottom (isolate 1.016, no thermals): 22.86,38.73 35.56,38.73 35.56,47.62 22.86,47.62
+12V  (via drill 0.5, 0.5 pad 0.3, 0.6, 0.6 pad 0.3, 0.7, 0.9 pad 0.3)
  Top 0.305: IC6.25 84.45,70.17 v85.09,70.8
  Top 0.406: U$9.VIN v50.16,35.56
  Top 0.61: C1.1 v85.72,8.26 86.13,8.66 IC4.3
  Top 0.813: C3.1 34.92,31.75 | 34.92,31.75 32.16,31.75 IC8.3 | v34.92,30.48 34.92,31.75
  Top 1.016: v53.34,15.24 v55.24,15.24 56.52,15.24 56.52,13.07 Q5.3 | v53.98,59.69 53.98,81.28 v53.34,81.92
  Bottom 0.406: C21.1 87.5,70.8 v85.09,70.8 82.23,70.8 76.83,76.2 | v50.16,35.56 53.98,35.56
  Bottom 0.61: 85.72,1.27 v85.72,8.26
  Bottom 0.813: 76.83,76.2 76.83,80.01
  Bottom 1.016: 85.72,1.27 53.98,1.27 53.98,15.24 | 76.83,80.01 55.24,80.01 v53.34,81.92 | v34.92,30.48 53.98,30.48 | v55.24,15.24 53.98,15.24 | 53.98,15.24 v53.34,15.24 | 53.98,15.24 53.98,30.48 | 53.98,30.48 53.98,35.56 v53.98,59.69
A1
  Top 0.813: U$9.A7 JP1.1
AIR_FLOW
  Top 0.61: U$1.15 9.42,68.58 R28.2
AIR_FLOW*
  Top 0.406: U$9.A12 45.09,73.66 42.55,71.12 28.57,71.12 27.94,70.48 17.14,70.48 17.14,68.58 C17.1
  Top 0.61: R28.1 C17.1
AIR_TEMP
  Top 0.406: U$1.14 9.19,74 9.53,73.66 R20.2 R19.1
AIR_TEMP*
  Top 0.406: R20.1 17.14,73.66 | 17.14,73.66 C11.1 | U$9.A14 45.09,78.74 44.45,79.38 21.59,79.38 17.14,74.93 17.14,73.66
AIR_V+  (1 unrouted)
  Top 0.406: FUSE1.1 11.43,52.7 9.53,50.8 9.53,49.52 U$1.19
BATT  (via drill 1)
  Top 1.422: U$1.13 3.81,16.31 3.81,1.91 38.1,1.91 46.99,10.79 Q5.4
  Top 1.676: Q8.3 20.41,10.79 v20.32,10.79 v18.41,10.79
  Bottom 1.676: U$1.13 4.46,16.5 5.71,15.24 13.97,15.24 v18.41,10.79 v20.32,10.79
  pour Top (isolate 1.016, rank 2, no thermals): 50.8,13.97 50.8,2.54 41.91,2.54 41.91,13.97
COIL1
  Top 0.61: R8.2 COIL1.1
  Bottom 0.813: COIL1.1 124.46,93.98 | COIL1.1 119.38,93.98 | COIL1.1 121.92,91.44
  pour Bottom (isolate 2.184, no thermals): 120.02,95.25 128.91,95.25 128.91,83.82 120.02,83.82
COIL1*
  Top 0.305: U$9.28 87,71.12 85.4,69.53 IC6.24
COIL2
  Top 0.61: R10.2 COIL2.1
  pour Bottom (isolate 2.184, no thermals): 120.02,49.53 128.91,49.53 128.91,38.1 120.02,38.1
COIL2*
  Top 0.305: IC6.23 85.7,68.88 87.63,70.8 87.63,78.11 89.53,80.01 U$9.26
COIL3
  Top 0.61: R12.2 COIL3.1
  pour Bottom (isolate 2.184, no thermals): 120.02,68.58 120.02,80.01 128.91,80.01 128.91,68.58
COIL3*
  Top 0.305: IC6.22 86,68.22 88.27,70.48 88.27,77.47 92.08,81.28 U$9.24
COIL4
  Top 0.61: COIL4.1 R14.2
  pour Bottom (isolate 2.184, no thermals): 120.02,64.77 128.91,64.77 128.91,53.34 120.02,53.34
COIL4*
  Top 0.305: IC6.21 86.31,67.58 88.9,70.17 88.9,76.83 90.81,78.74 92.08,78.74 94.61,81.28 U$9.22
COIL_MAX_I  (via drill 0.5 pad 0.3)
  Top 0.305: IC6.29 82.62,72.78 83.19,73.34 v83.19,75.56 | v91.44,75.88 95.06,75.88 U$9.21
  Bottom 0.305: v83.19,75.56 83.5,75.88 v91.44,75.88
COIL_NOM_I  (via drill 0.5 pad 0.3)
  Top 0.305: IC6.28 82.92,72.12 84.14,73.34 84.14,74.3 v84.45,74.61 | v94.61,74.3 98.3,74.3 U$9.20
  Bottom 0.305: v84.45,74.61 90.81,74.61 91.12,74.3 v94.61,74.3
CRANKING
  Top 0.61: U$1.21 9,37.47 12.06,37.47 R27.2
CRANKING*  (1 unrouted)
  Top 0.61: C18.1 15.24,42.55 | R27.1 12.06,42.55 15.24,42.55 | D2.C 15.24,42.55
CS_INJ*
  Top 0.305: IC6.4 70.73,72.78 70.48,73.03 70.48,77.47 71.75,78.74 74.3,78.74 76.83,81.28 U$9.36
CS_SD  (via drill 0.6 pad 0.3)
  Top 0.406: IC1.2 72.52,20.32 72.52,22.86 74.3,22.86 75.56,24.13 78.11,24.13 80.01,22.23 v80.01,20.95 | U$9.12 95,20.95 v92.08,20.95
  Bottom 0.406: v92.08,20.95 v80.01,20.95
DRIV_EN
  Top 0.305: IC6.9 67,69.53 65.41,71.12 65.41,73.66 71.44,79.69 73.66,79.69 74.3,80.33 U$9.38
FUEL*
  Top 0.406: Q6.1 20,48.9 34.92,48.9 38.73,52.7 38.73,59.69 42.55,63.5 U$9.A8
FUEL_PUMP
  Top 0.61: U$1.20 9.07,44 10.79,45.72 12.07,45.73 D1.C 15.87,45.73 15.88,45.72 | 15.88,45.72 C6.1 15.88,46.35 | Q6.3 19.05,45.72 15.88,45.72
FULL/IDL
  Top 0.406: U$1.4 4,61.59 9.53,61.59 11.43,59.69 23.5,59.69 28.57,64.77 30.48,64.77 R16.1 32.87,65.25 R17.2
GND  (via drill 0.5, 0.5 pad 0.3, 0.8 pad 0.3, 0.9, 0.9 pad 0.3)  (42 unrouted)
  Top 0.305: 78.46,71.47 IC6.V1 | IC6.27 83.22,71.47 v85.09,73.34 | v101.28,69.53 104.46,69.53 108.9,65.41 121.92,65.41 arc-90 126.36,60.96 126.36,55.72 R6.1
  Top 0.406: IC1.1 74.28,21.34 75.56,21.34 75.56,18.41 74.3,18.41 | 69.22,18.41 69.22,21.34 67.92,21.34 IC3.1 | IC5.1 61.58,21.34 62.87,21.34 62.87,18.41 62.23,18.41 | IC1.3 74.3,19.37 74.3,18.41 | IC5.3 61.58,18.41 62.23,18.41 | IC3.3 67.94,19.37 67.94,18.41 69.22,18.41 | 65.66,4.84 U$3.P$3 65.61,1.91 | 22.86,84.89 C5.2 | R4.3 26.67,90.27 26.67,88.27 25.15,88.27 25.15,83.19 IC7.2 | C17.2 20.32,69.22 v24.77,69.22 | C11.2 v24.77,73.66 | v35.56,67.94 38.73,67.94 C9.2 | 18.1,49.53 18.41,49.53 18.41,50.8 v24.77,50.8 | 69.85,48.9 IC11.2 62.87,48.9 C19.2 | 71.12,52.7 C15.2 | IC2.1 110.81,27.94 | 110.81,27.94 108.91,27.94 IC2.3 | U$4.P$9 U$4.P$2 U$4.P$3 | 73.25,13.34 U$3.P$10 73.36,13.34 74.3,13.34 74.3,18.41 | 61.97,12.7 U$3.P$9 62.29,12.56 U$3.P$11 62.23,14.06 62.23,18.41 | 69.22,18.41 69.22,17.78 70.48,17.78 70.48,13.34 | v24.77,55.88 24.13,56.52 C23.2 | C24.2 v24.77,64.77 | 110.81,27.94 111.76,27.94 113.03,29.21
  Top 0.61: C7.2 39.37,15.88 | Q6.2 18.1,49.53 15.88,49.53 | 15.88,49.53 C6.2 | D1.A 15.88,49.53 | C10.2 v40.01,73.66 | C12.2 69.85,52.7 | 69.85,52.7 C15.2 | 69.85,48.9 69.85,52.7 | C2.2 78.11,8.26 C1.2 81.15,11.51 IC4.1 | IC9.1 35.97,15.88 39.37,15.88 | 39.37,15.88 C8.2 | 73.25,13.34 70.48,13.34 69.85,12.7 61.97,12.7
  Top 0.813: 27.53,31.75 IC8.1 | C3.2 33.15,36.33
  Bottom 0.305: v85.09,73.34 97.47,73.34 v101.28,69.53 | C21.2 89.85,70.48 89.85,67.94 78.14,67.94 IC6.V2 | IC6.V4 75.56,67.9 75.56,69.22 C22.2
  Bottom 0.406: v24.77,73.66 25.4,73.66 | v35.56,67.94 25.4,67.94 | v24.77,55.88 25.4,55.88 | v24.77,50.8 25.4,50.8 | v24.77,69.22 25.4,69.22 | v24.77,64.77 25.4,64.77
  Bottom 0.61: v40.01,73.66 25.4,73.66
  Bottom 0.813: 25.4,73.66 25.4,69.22 25.4,67.94 25.4,64.77 25.4,55.88 25.4,50.8 v30.48,50.8
  other vias: 43.18,17.78 43.18,15.88 105.41,97.79 103.5,97.79 101.6,97.79
  pour Top (isolate 1.016, rank 3): 1.27,98.42 1.27,1.27 129.54,1.27 129.54,98.42
  pour Bottom (isolate 1.016, rank 3): 1.27,98.42 1.27,1.27 129.54,1.27 129.54,34.29 106.05,34.29 106.05,98.42
IDL_SW*
  Top 0.406: C9.1 39.88,65.28 43.18,68.58 U$9.A10
  Top 0.61: R17.1 38.6,65.41 C9.1
INJ1
  Top 1.016: U$1.12 4.09,21.59 INJ.1.1
INJ1*  (via drill 0.5)
  Top 0.305: IC6.10 66.38,68.88 64.77,70.48 64.77,74.93 v66.04,76.2 | v61.59,76.2 U$9.48
  Bottom 0.305: v66.04,76.2 v61.59,76.2
INJ2
  Top 1.016: U$1.11 4.17,26.67 INJ.2.1
INJ2*
  Top 0.305: IC6.11 65.76,68.22 64.14,69.85 64.14,76.2 69.22,81.28 U$9.42
INJ3
  Top 1.016: U$1.24 9.13,24.13 INJ.3.1
INJ3*
  Top 0.305: IC6.12 65.14,67.58 63.5,69.22 63.5,76.83 66.67,80.01 U$9.44
INJ4
  Top 1.016: U$1.23 9.21,29.21 INJ.4.1
INJ4*
  Top 0.305: IC6.13 64.52,66.92 62.87,68.58 62.87,77.79 64.14,79.06 U$9.46
KNOCK*
  Top 0.406: IC11.4 62.87,46.35 C19.1 62.87,45.72 U$9.A2
MISO  (via drill 0.5, 0.6)
  Top 0.305: IC6.7 69.83,70.83 68.26,72.39 v66.67,72.39 | v59.69,72.39 59.05,72.39
  Top 0.406: U$3.P$2 64.52,6.99 v60.33,6.99 | U$9.50 59.05,72.39 v59.05,55.88 | IC11.11 73.03,38.73 70.48,41.27 v69.85,41.27
  Bottom 0.305: v66.67,72.39 v59.69,72.39
  Bottom 0.406: v60.33,6.99 60.33,17.78 59.05,19.05 59.05,41.27 | v59.05,55.88 59.05,41.27 | v69.85,41.27 59.05,41.27
MOSI  (via drill 0.5)
  Top 0.305: IC6.6 70.13,71.47 v67.94,73.66 | U$9.51 59.05,85.72 57.78,84.45 v57.78,73.66
  Top 0.406: IC3.2 66.67,20.32 66.67,24.13 66.04,24.77 62.87,24.77 61.59,23.5 59.05,23.5 v57.78,22.23 | v57.78,73.66 v57.78,57.15 | IC11.12 73.66,40.01 v71.12,42.55 | v60.96,42.55 v57.78,42.55
  Bottom 0.305: v57.78,42.55 v57.78,22.23 | v67.94,73.66 v57.78,73.66
  Bottom 0.406: v57.78,57.15 v57.78,42.55 | v71.12,42.55 v60.96,42.55
MOSI3  (via drill 0.6)
  Top 0.406: IC3.4 72.52,19.37 v72.52,19.05 | v68.96,6.99 68.92,6.99 U$3.P$6
  Bottom 0.406: v72.52,19.05 72.52,17.27 69.22,13.97 69.22,7.24 v68.96,6.99
N$1
  Top 0.406: IC7.3 26.63,81.78 C5.1 22.86,81.48 D7.C 20.32,81.28 17.78,81.28 R3.2
N$2
  Top 0.61: C7.1 39.37,20.32 38.73,20.95 32.38,20.95 31.34,19.91 31.34,19.68 IC9.3
  Top 0.813: Q8.1 18.41,17.52 18.41,19.68 31.34,19.68 | U$4.P$1 15.88,8.26 15.88,12.96 Q8.5
  Top 1.016: 24.77,10.79 30.48,10.79 30.48,14.61 31.34,15.47 IC9.3
  Top 1.27: U$4.P$10 U$4.P$1 24.77,10.79
N$3  (via drill 0.5 pad 0.3, 1 pad 1.68)
  Top 0.305: IC6.26 83.48,70.83 84.73,72.07 v85.72,72.07
  Top 2.54: v103.5,81.92 121.92,81.92 123.83,80.01 R6.2
  Bottom 0.305: 107.95,68.26 100.65,68.26 96.84,72.07 v85.72,72.07
  Bottom 1.778: Q1.3 107.95,92.08 107.95,81.92 107.95,76.83 | Q2.3 107.95,46.35 107.95,61.59 | Q4.3 107.95,61.59 | Q3.3 107.95,76.83 | 107.95,61.59 107.95,68.26 107.95,76.83
  Bottom 2.184: v103.5,81.92 v105.41,81.92
  Bottom 2.54: v105.41,81.92 v107.31,81.92 107.95,81.92
N$4  (via drill 0.5 pad 0.3)
  Top 0.305: IC6.14 74.06,66.28 79.38,60.96 90.17,60.96 v90.81,61.59
  Bottom 0.305: v90.81,61.59 96.52,61.59 99.06,59.05 99.06,45.72 102.87,41.91 103.5,41.91 Q2.1
  Bottom 0.406: Q2.1 105.41,41.27
N$6  (via drill 0.5 pad 0.3)
  Top 0.305: IC6.2 73.76,74.08 74.3,74.61 74.3,77.47 76.2,79.38 v78.42,79.38 | v100.97,89.53 101.6,90.17 110.49,90.17
  Top 0.61: R7.1 110.49,93.98 R29.2 110.49,90.17
  Bottom 0.305: v78.42,79.38 80.01,80.96 80.96,80.96 81.28,80.64 99.69,80.64 99.69,89.53 v100.97,89.53
N$7  (via drill 0.5 pad 0.3)
  Top 0.305: IC6.3 74.06,73.42 74.93,74.3 74.93,76.83 76.2,78.11 78.74,78.11 v80.33,79.69
  Bottom 0.305: v80.33,79.69 80.96,79.38 100.97,79.38 100.97,87 Q1.1
N$8
  Top 0.406: Q7.3 23.41,22.61 21.76,20.95 17.78,20.95 15.88,19.05 15.88,16.38 Q8.2
N$9
  Top 0.305: IC6.1 72.39,74.72 72.39,74.93
  Top 0.61: 72.39,74.93 INJ1.1
N$10
  Top 0.406: IC11.19 79.38,48.9 79.38,49.53 R21.2 79.86,52.55 R22.1
N$11
  Top 0.406: IC7.1 26.52,84.14 | R5.1 33.02,85.72 27.94,85.72 | 26.63,84.07 IC7.1 | IC7.1 27.94,84.14 27.94,85.72 | 27.94,85.72 R4.2
N$12
  Top 0.305: IC6.15 73.44,65.62 78.74,60.33 91.44,60.33 93.98,62.87 95.89,62.87 98.42,61.59 106.68,61.59 108.58,59.69 108.58,42.55 110.97,42.55 R30.2
  Top 0.61: R9.1 111.12,38.73 R30.2
N$13  (via drill 0.5 pad 0.3)
  Top 0.305: IC6.30 79.93,73.42 78.11,75.25 78.11,76.2 80.33,78.42 84.14,78.42 v85.41,77.15
  Bottom 0.305: Q3.1 101.28,71.75 95.89,77.15 v85.41,77.15
N$14
  Top 0.406: 108.67,22.14 108.91,22.14 IC2.4
  Top 0.61: JP4.3 109.86,20.95 108.67,22.14 XB1.3
N$15
  Top 0.61: C8.1 39.37,10.16 33.66,10.16 | 33.66,10.16 IC9.4 IC9.2 | 33.66,10.16 32.38,10.16 U$4.P$4
N$16  (via drill 0.5 pad 0.3)
  Top 0.305: IC6.31 80.23,74.08 79.38,74.93 v79.38,75.56 | v100.97,75.56 110.97,75.56 R31.2
  Top 0.61: R11.1 111.12,71.75 R31.2
  Bottom 0.305: v79.38,75.56 79.38,77.47 80.33,78.42 98.11,78.42 v100.97,75.56
N$17  (via drill 0.5 pad 0.3)
  Top 0.305: IC6.19 91.2,66.28 v91.44,66.04
  Bottom 0.305: v91.44,66.04 93.98,66.04 102.23,57.78
  Bottom 0.406: Q4.1 103.5,56.52 102.23,57.78
N$18
  Top 0.406: IC11.18 81.92,47.62 82.55,48.26 82.55,49.53 R21.1
N$19
  Top 0.305: IC6.18 89.95,65.62 91.44,64.14 95.89,64.14 98.42,65.41 104.78,65.41 109.22,60.96 R13.1
  Top 0.61: R13.1 111.12,60.96 R32.2
N$20
  Top 0.406: R22.2 80.64,55.38 C13.1
N$21
  Top 0.406: IC11.16 79.38,45.09 79.38,44.45 R23.2 79.86,41.43 R24.1
N$22
  Top 0.406: R24.2 80.64,38.6 C14.1
N$23
  Top 0.406: IC11.20 74.3,50.16 | 74.3,50.16 74.3,47.62 | 74.3,47.62 74.3,43.81 IC11.15 | IC11.3 74.3,47.62 | C15.1 74.3,52.7 74.3,50.16
N$24
  Top 0.406: IC11.17 81.92,46.35 82.55,45.72 82.55,44.45 R23.1
N$25  (via drill 0.8 pad 0.3)
  other vias: 46.35,33.02
N$26
  Top 0.305: IC6.16 71.75,64.97 71.75,64.77
  Top 0.61: 71.75,64.77 INJ2.1
N$27
  Top 0.305: IC6.32 81.28,74.72 81.28,74.93
  Top 0.61: 81.28,74.93 INJ3.1
N$28
  Top 0.406: R25.1 64.14,38.1 64.14,38.73 IC11.10 66.55,38.68 66.55,34.92 | QF1.1 66.55,34.92 | C20.1 66.68,35.05 66.55,34.92
N$29
  cutout Top (isolate 1.016): 32.38,95.89 32.38,89.53 53.34,89.53 53.34,95.89
N$30
  Top 0.406: IC11.9 60.81,40.01 R25.2 60.96,38.1 60.96,34.92 61.59,34.29 QF1.3 61.47,34.03 C16.1
N$31
  Top 0.305: IC6.17 81.92,64.97 81.92,64.77
  Top 0.61: 81.92,64.77 INJ4.1
N$34
  Top 0.406: C13.2 83.82,52.07 KNOCK1.1
N$35
  Top 0.406: C14.2 83.82,41.91 KNOCK2.1
N$36
  Top 0.406: U$9.23 JP6.1
N$37
  cutout Top: 10.79,50.8 10.79,47.62 21.59,47.62 21.59,50.8
N$38
  cutout Top: 16.51,84.45 16.51,80.64 34.29,80.64 34.29,84.45
N$39  (via drill 0.6)
  other vias: 36.83,78.11
N$40
  cutout Top: 74.3,72.39 79.38,72.39 79.38,67.31 74.3,67.31
N$41
  cutout Top: 37.47,18.41 34.92,18.41 34.92,12.06 37.47,12.06
N$42
  cutout Top: 107.95,29.84 111.76,29.84 111.76,26.04 107.95,26.04
N$43
  Top 0.61: R8.1 R7.2
N$44
  Top 0.61: R9.2 R10.1
N$45
  Top 0.61: R12.1 R11.2
N$46
  Top 0.61: R14.1 R13.2
N$47
  cutout Top (isolate 1.016, no thermals): 111.12,67.94 111.12,75.56 121.92,75.56 arc-180 121.92,67.94
  cutout Top (isolate 1.016, no thermals): 111.12,57.15 111.12,64.77 121.92,64.77 arc-180 121.92,57.15
  cutout Top (isolate 1.016, no thermals): 111.12,90.17 111.12,97.79 121.92,97.79 arc-180 121.92,90.17
  cutout Top (isolate 1.016, no thermals): 111.12,34.92 111.12,42.55 121.92,42.55 arc-180 121.92,34.92
N$48
  Top 0.406: 32.38,89.53 32.38,95.89 53.34,95.89 53.34,89.53 32.38,89.53
N$49
  Top 0.813: U$9.A6 JP1.2
N$50
  Top 0.813: U$9.A5 JP1.3
N$51
  Top 0.813: U$9.A4 JP1.4
N$52
  Top 0.813: U$9.A3 JP1.5
N$53
  Top 0.61: U$9.11 98.68,24.13 92.71,24.13 91.44,25.4 JP2.1
N$54
  Top 0.61: U$9.10 95.12,26.67 92.71,26.67 91.44,27.94 JP2.2
N$55
  Top 0.61: U$9.9 98.68,29.21 92.71,29.21 91.44,30.48 JP2.3
N$56
  Top 0.61: U$9.8 95.38,31.75 92.71,31.75 91.44,33.02 JP2.4
N$57
  Top 0.61: JP4.4 109.86,18.41 108.12,20.14 XB1.4
N$58
  Top 0.61: JP4.5 109.86,15.88 107.58,18.14 XB1.5
N$59
  Top 0.61: JP4.6 109.86,13.34 107.05,16.14 XB1.6
N$60
  Top 0.61: JP5.10 124.98,26.14 XB1.20
N$61
  Top 0.61: JP5.9 124.44,24.14 XB1.19
N$62
  Top 0.61: JP5.8 123.91,22.14 XB1.18
N$63
  Top 0.61: JP5.7 123.36,20.14 XB1.17
N$64
  Top 0.61: JP5.6 122.83,18.14 XB1.16
N$65
  Top 0.61: JP5.5 122.83,16.14 XB1.15
N$66
  Top 0.61: JP5.4 123.36,14.14 XB1.14
N$67
  Top 0.61: JP5.3 123.91,12.14 XB1.13
N$68
  Top 0.61: JP5.2 124.44,10.14 XB1.12
N$69
  Top 0.61: JP5.1 124.98,8.14 XB1.11
N$70
  Top 0.61: JP4.7 109.22,10.79 108.6,10.14 XB1.9
N$71
  Top 0.406: U$9.25 JP6.2
N$72
  Top 0.406: U$9.27 JP6.3
N$73
  Top 0.406: U$9.29 JP6.4
N$74
  Top 0.406: U$9.31 JP6.5
N$75
  Top 0.406: U$9.33 JP7.1
N$76
  Top 0.406: JP7.2 U$9.35
N$77
  Top 0.406: U$9.37 JP7.3
N$78
  Top 0.406: JP7.4 U$9.39
N$79
  Top 0.406: U$9.41 JP7.5
N$80
  Top 0.406: U$9.43 JP8.1
N$81
  Top 0.406: JP8.2 U$9.45
N$82
  Top 0.406: U$9.47 JP8.3
N$83
  Top 0.406: JP8.5 56.52,93.98 U$9.53
NOT_GND
  cutout Top (isolate 0.813, rank 2, no thermals): 60.33,22.23 78.11,22.23 78.11,17.78 60.33,17.78
O2_PWR*
  Top 0.406: Q7.1 30.55,21.66 31.11,22.23 40.01,22.23 43.18,25.4 43.18,40.01 46.35,43.18 U$9.A1
O2_SENS
  Top 0.406: R2.2 4.01,56.52 U$1.5
O2_SENS*
  Top 0.406: U$9.A9 42.55,66.04 40.01,63.5 28.57,63.5 23.5,58.42 17.14,58.42 17.14,56.52 C23.1 R2.1
OIL
  Top 0.406: R1.2 10.18,66.5 U$1.3
OIL*
  Top 0.406: U$9.A11 45.72,71.12 44.45,69.85 29.21,69.85 26.67,67.31 22.86,67.31 22.23,66.67 17.02,66.67 C24.1 R1.1
OIL_V+
  Top 0.406: FUSE2.1 11.4,61.59 U$1.16
SCK  (via drill 0.5)
  Top 0.305: IC6.5 70.43,72.12 69.22,73.34 v69.22,74.93 | v55.88,74.93 56.52,74.93
  Top 0.406: U$9.52 56.52,74.93 v56.52,58.42 | IC11.13 74.3,41.27 71.75,43.81 v69.85,43.81 | v62.23,43.81 v55.88,43.81 | IC5.2 v56.52,20.32
  Bottom 0.305: 56.52,43.81 56.52,24.77 | v69.22,74.93 v55.88,74.93
  Bottom 0.406: v56.52,58.42 56.52,43.81 v55.88,43.81 | v69.85,43.81 v62.23,43.81 | v56.52,20.32 56.52,24.77
SCK3  (via drill 0.6)
  Top 0.406: U$3.P$4 66.67,4.84 v66.67,6.99 | IC5.4 65.91,19.37 v65.91,18.8
  Bottom 0.406: v66.67,6.99 66.67,18.8 v65.91,18.8
SEL3
  Top 0.406: IC1.4 76.83,19.37 76.83,17.14 75.56,17.14 75.56,6.99 70.02,6.99 U$3.P$7
SPRK_DUR
  Top 0.305: IC6.20 86.61,66.92 89.53,69.85 89.53,76.2 91.44,78.11 94.61,78.11 96.52,80.01 96.52,85.09 61.59,85.09 U$9.49
  Top 0.406: JP8.4 U$9.49
TACH  (2 unrouted)
  Top 0.406: R3.1 17.78,85.09 15.24,85.09 15.24,80.01 7.62,80.01 4.11,76.5 U$1.1
TACH*  (1 unrouted)
  Top 0.406: IC7.4 33.02,82.23 | 33.02,82.23 R5.2 | U$9.A15 33.02,81.28 33.02,82.23
TEMP
  Top 0.406: U$1.2 4,71.75 27.3,71.75 29.21,73.66 R18.2 30.48,73.66 30.48,76.83 R15.1
TEMP*
  Top 0.406: U$9.A13 35.56,76.2 35.56,73.66 C10.1 R18.1
VCC  (via drill 0.5, 0.6, 0.8)
  Top 0.406: IC5.5 64.14,21.27 v64.14,22.86 | v76.86,22.86 IC1.5 | IC3.5 70.48,21.27 v70.48,22.86 | U$3.P$5 67.94,4.84 v67.94,8.51 | IC2.5 110.81,24.77 v110.49,24.77
  Top 0.61: C2.1 78.11,14.61 83.82,14.61 | 83.82,14.61 IC4.2 | 83.82,14.61 IC4.4 83.82,19.05 81.28,21.59 v81.28,23.5 | JP4.1 112.39,26.04 111.12,24.77 v110.49,24.77
  Bottom 0.406: v64.14,22.86 67.94,22.86 | 67.94,22.86 v70.48,22.86 v76.86,22.86 | v67.94,8.51 67.94,22.86 | 104.46,26.04 XB1.1 109.11,26.14 v110.49,24.77
  Bottom 0.61: v76.86,22.86 81.28,22.86 | 81.28,22.86 99.06,22.86 102.23,26.04 104.46,26.04 | 81.28,22.86 v81.28,23.5
WBO2*  (via drill 0.6 pad 0.3, 0.7)
  Top 0.406: U$4.P$7 32.38,3.81 36.83,3.81 38.1,5.08 v38.1,7.62 | U$9.A0 47.62,40.64 44.45,37.47 44.45,24.13 v43.18,22.86
  Bottom 0.406: v38.1,7.62 38.1,17.78 v43.18,22.86
XBEE_RX
  Top 0.406: U$9.15 95.89,60.96 95.89,59.69 91.44,55.24 91.44,34.92 93.34,33.02 102.23,33.02 106.68,28.57 106.68,25.4 105.41,24.13 104.58,24.13 XB1.2
  Bottom 0.61: JP4.2 112.39,23.5 111.76,22.86 108.58,22.86 107.3,24.14 XB1.2
XBEE_TX
  Top 0.406: U$9.14 95.89,58.42 92.71,55.24 92.71,35.56 94.36,33.91 103.25,33.91 106.05,31.11 109.86,31.11 IC2.2

### Text on the board
Top: ECUality 1.2 | 2-2015
tPlace: KNOCK SENSOR / TPIC8101 | 20 | +5V | Gnd | 1 | 17 | 14 | 11
tNames: Inj3 | Inj1 | Inj2 | Inj4